# Altium schematic sheet 2_Power_Supply.SchDoc
size A4; SheetNumber: 2; SheetTotal: 3
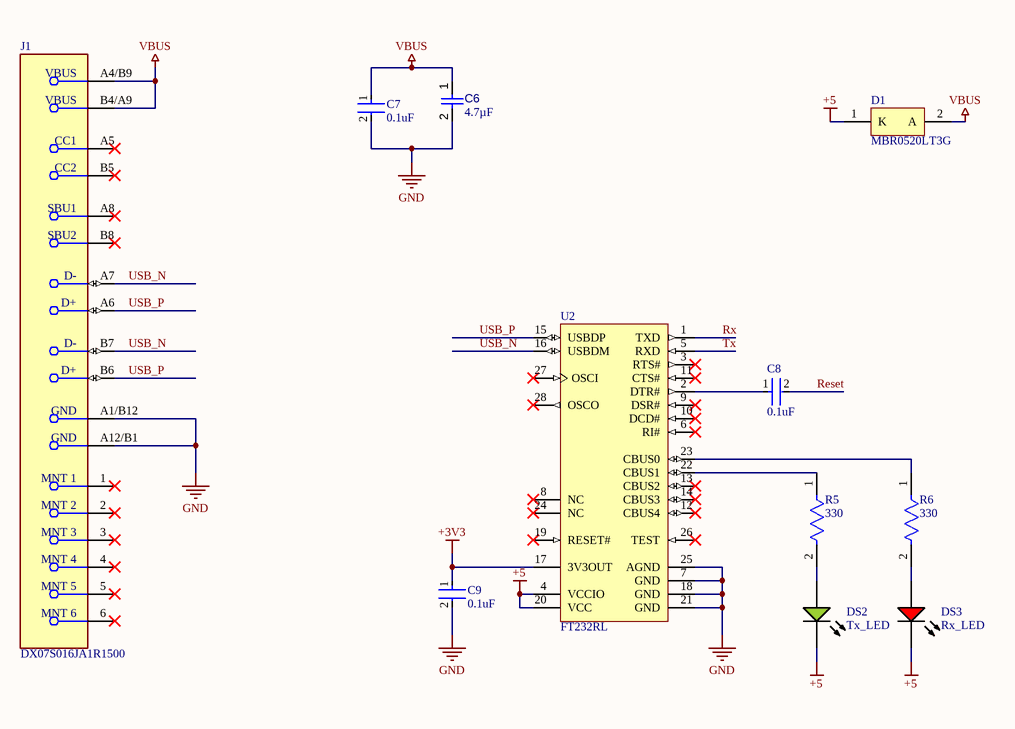
[diagram p0: 2_Power_Supply.SchDoc]

## Parts
C6  value 4.7µF  [CAPC0805(2012)145_L]  (hidden comment: Capacitor 4.7µF +/-40% 25V 0805)
C7  0.1uF  [FP-C0805C-DN-MFG]
C8  0.1uF  [FP-C0805C-DN-MFG]
C9  0.1uF  [FP-C0805C-DN-MFG]
D1  MBR0520LT3G  [ONSC-SOD-123-2-425-04_V]
DS2  Tx_LED  [EVRL-0603-2_V]
DS3  Rx_LED  [EVRL-0603-2_V]
J1  DX07S016JA1R1500  [FP-DX07S016JA1R1500-MFG]
R5  330  [FP-CRCW0805-e3-MFG]
R6  330  [FP-CRCW0805-e3-MFG]
U2  FT232RL  [FTDI-SSOP-28_M]

## Nets
+3V3: C9.1 U2.17(3V3OUT)
+5: D1.1(K) DS2.2(K) DS3.2(K) U2.4(VCCIO) U2.20(VCC)
GND: C6.2 C7.2 C9.2 J1.A1/B12(GND) J1.A12/B1(GND) U2.7(GND) U2.18(GND) U2.21(GND) U2.25(AGND)
VBUS: C6.1 C7.1 D1.2(A) J1.A4/B9(VBUS) J1.B4/A9(VBUS)
Reset: C8.2
Rx: U2.1(TXD)
Tx: U2.5(RXD)
USB_N: J1.A7(D-) J1.B7(D-) U2.16(USBDM)
USB_P: J1.A6(D+) J1.B6(D+) U2.15(USBDP)
NetC8_1: C8.1 U2.2(DTR#)
NetDS2_1: DS2.1(A) R5.2
NetDS3_1: DS3.1(A) R6.2
NetR5_1: R5.1 U2.22(CBUS1)
NetR6_1: R6.1 U2.23(CBUS0)

Not connected (* = marked no-connect by the designer): J1 1(MNT_1)* 2(MNT_2)* 3(MNT_3)* 4(MNT_4)* 5(MNT_5)* 6(MNT_6)* A5(CC1)* A8(SBU1)* B5(CC2)* B8(SBU2)*; U2 3(RTS#)* 6(RI#)* 8(NC)* 9(DSR#)* 10(DCD#)* 11(CTS#)* 12(CBUS4)* 13(CBUS2)* 14(CBUS3)* 19(RESET#)* 24(NC)* 26(TEST)* 27(OSCI)* 28(OSCO)*

## Library data of the parts
C6 = CMP-001-00080-4: Chip Capacitor, 4.7µF +/-40%, 25V, 0805, Thickness 1.45 mm; Tolerance: 20%; Voltage Rating: 25V; Min Operating Temperature: -55°C; Max Operating Temperature: 85°C; Pins: 2; Mounting Technology: SMT; Case/Package: 0805
C7-C9 = CMP-03020-002581-2: C0805 0.10 μF X7R 30ppm/°C 20.00% 50 V; Manufacturer Part Number: C0805C104M5RAC; Manufacturer: KEMET; Capacitance: 0.10 μF; Voltage Rating: 50 V; Value: 0.10 μF; Tolerance: 0.2; Material: Ceramic; Category: Cap; Temperature: -55°C to +125°C; Lead Free: Yes; Device Class L3: Ceramic Capacitors; Package: C0805C-DN; Height: 0.88mm; Temperature Range High: +125°C; Device Class L2: Capacitors; Device Class L1: Passive Components; Temperature Coefficient: 30ppm/°C; ComponentLink2Description: Datasheet; RoHS: TRUE; Temperature Range Low: -55°C; ComponentLink2URL: https://content.kemet.com/datasheets/KEM_C1003_C0G_SMD.pdf; Temperature Characteristic: X7R; Mouser Description: Multilayer Ceramic Capacitors MLCC - SMD/SMT 50volts 0.1uF 20% X7R; Octopart: https://octopart.com/c0805c104m5rac-kemet-2226142; Ipc Land Pattern Name: CAPC200125X78; Automotive: No
D1 = CMP-1055-00408-1: Schottky Power Rectifier, 2-Pin SOD-123, Pb-Free, Tape and Reel; Manufacturer: On Semiconductor; Configuration: Single; IFSM Max (A): 5.5; PackageReference: SOD-123-2-425-04; ComponentLink3URL: http://www.onsemi.com/pub_link/Collateral/425-04.PDF; Mounting Technology: Surface Mount; PartNumber: MBR0520LT3G; ComponentLink1URL: http://www.onsemi.com/; ComponentLink1Description: Manufacturer URL; Packing: Tape and Reel; PackageDescription: 2-Pin SOD, Body 1.6 x 2.69 mm; ComponentLink2URL: http://www.onsemi.cn/pub_link/Collateral/MBR0520LT1-D.PDF; RoHS: TRUE; ComponentLink3Description: Package Specification; DatasheetVersion: Rev. 6; PackageVersion: Rev. G, 10/2009; ComponentLink2Description: Datasheet
DS2 = CMP-007-00002-2: Chip LED, Yellow-Green, 5 V, 25 mA, -40 to 85 degC, 2-Pin SMD (0603), RoHS, Tape and Reel; Manufacturer: Everlight Electronics; Forward Voltage: 2V; Lens Style: Clear; Viewing Angle: 120degrees; Colour: Green; Mounting Technology: SM; Datasheet Version: Rev. 1, 04/2006; Package Description: 2-Pin Surface Mount Device, Body 1.6 x 0.8 mm; RoHS Compliant: True; Package Reference: 0603; Pins: 2; Manufacturer URL: http://www.everlight.com/; Datasheet URL: https://datasheet.ciiva.com/48679/19-217-g7c-an1p2-3t-48679179.pdf; Case/Package: 0603
DS3 = CMP-007-00004-2: Chip LED, Red, 5 V, 25 mA, -40 to 85 degC, 2-Pin SMD (0603), RoHS, Tape and Reel; Manufacturer: Everlight Electronics; Forward Voltage: 2.2V; Lens Style: Clear; Package Reference: 0603; Datasheet Version: Rev. 1, 01/2005; Mounting Technology: SM; RoHS Compliant: False; Datasheet URL: https://datasheet.ciiva.com/4688/el-19-217-r6c-al1m2vy-3tpdf-187026-4688713.pdf; Case/Package: 0603; Colour: Red; Manufacturer URL: http://www.everlight.com/; Package Description: 2-Pin Surface Mount Device, Body 1.6 x 0.8 mm
J1 = CMP-19038-000003-1: CONN RCP USB2.0 TYP C 24P SMD RA
R5 R6 = CMP-2001-03823-2: RES Thick Film, 330Ω, 1%, 0.125W, 100ppm/°C, 0805; Voltage Rating (DC): 150V; Resistance: 330R; Max Power Dissipation: 125mW; Mount: Surface Mount; Packaging: Tape and Reel; Min Operating Temperature: -55°C; Military Standard: Not; Case Code (Metric): 2012; Height: 0.02inch; Voltage Rating: 150V; Case/Package: 0805; Max Operating Temperature: 155°C; Width: 0.049inch; Case Code (Imperial): 0805; Termination: SMD/SMT; Lead Free: Lead Free; Contact Plating: Tin; Package Quantity: 10; Composition: Thick Film; Length: 2mm; Features: Automotive AEC-Q200; Depth: 1.25mm; Weight: 0.000194oz; Tolerance: 1%; Power Rating: 125mW; Number of Terminations: 2; Temperature Coefficient: 100ppm/°C
U2 = CMP-2000-05029-1: IC USB FS SERIAL UART 28-SSOP; Manufacturer: FTDI; Receive FIFO: 256B; Number of Channels per Chip: 1; Maximum Data Rate: 3MBd; Transmit FIFO: 128B; Dimensions: 10.2x5.3x1.75mm; Mounting Type: SurfaceMount; Height: 1.75mm; Package Type: SSOP; Datasheet Version: Rev. 1.04, 02/2006; Width: 5.3mm; Manufacturer URL: http://www.ftdichip.com/; Datasheet URL: http://datasheet.octopart.com/FT232RL-FTDI-datasheet-120501.pdf; Maximum Operating Temperature: +85degC; Minimum Operating Temperature: -40degC; Pin Count: 28; Length: 10.2mm